# Altium schematic sheet SCC.SchDoc: Solar Charge Controller
size A4; Organization: Thomas Hofmann; Address1: Oberndorferstrasse 41; Address2: 3133 Traismauer; Address3: Lower Austria; Address4: Austria; DocumentNumber: 1; Revision: 1.0; SheetNumber: 1; SheetTotal: 1
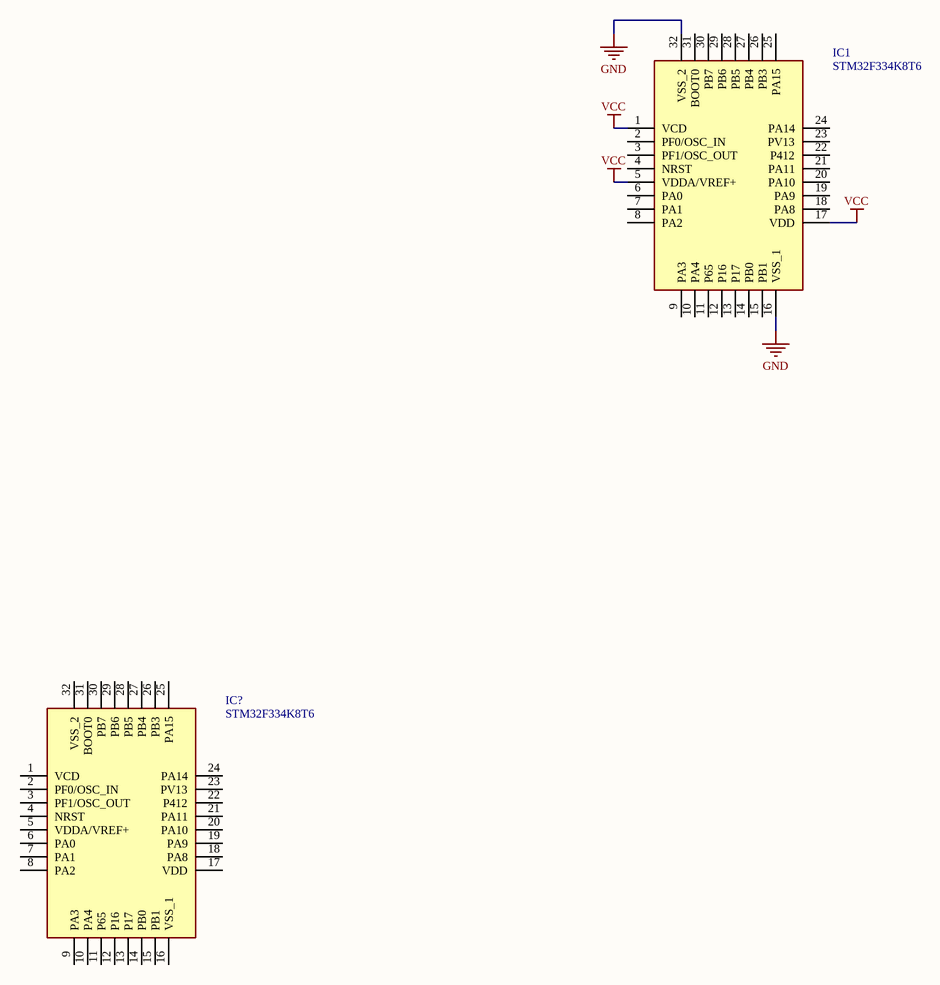
[diagram p0: SCC.SchDoc]

## Parts
IC1  STM32F334K8T6  [QFP80P900X900X160-32N]
IC?  STM32F334K8T6  [QFP80P900X900X160-32N]

## Nets
GND: IC1.16(VSS_1) IC1.32(VSS_2)
VCC: IC1.1(VCD) IC1.5(VDDA/VREF+) IC1.17(VDD)

Not connected (* = marked no-connect by the designer): IC1 2(PF0/OSC_IN) 3(PF1/OSC_OUT) 4(NRST) 6(PA0) 7(PA1) 8(PA2) 9(PA3) 10(PA4) 11(P65) 12(P16) 13(P17) 14(PB0) 15(PB1) 18(PA8) 19(PA9) 20(PA10) 21(PA11) 22(P412) 23(PV13) 24(PA14) 25(PA15) 26(PB3) 27(PB4) 28(PB5) 29(PB6) 30(PB7) 31(BOOT0); IC? 1(VCD) 2(PF0/OSC_IN) 3(PF1/OSC_OUT) 4(NRST) 5(VDDA/VREF+) 6(PA0) 7(PA1) 8(PA2) 9(PA3) 10(PA4) 11(P65) 12(P16) 13(P17) 14(PB0) 15(PB1) 16(VSS_1) 17(VDD) 18(PA8) 19(PA9) 20(PA10) 21(PA11) 22(P412) 23(PV13) 24(PA14) 25(PA15) 26(PB3) 27(PB4) 28(PB5) 29(PB6) 30(PB7) 31(BOOT0) 32(VSS_2)

## Notes on the sheet
- Title
- Size:
- Date:
- A4
- Number:
- Time:
- Revision:
- Sheet
- of
- File:

## Library data of the parts
IC1 IC? = STM32F334K8T6: Integrated Circuit; Manufacturer_Name: STMicroelectronics; Datasheet Link: http://www.st.com/content/ccc/resource/technical/document/datasheet/d1/cd/3d/18/a2/2c/4e/d0/DM00097745.pdf/files/DM00097745.pdf/jcr:content/translations/en.DM00097745.pdf; Height: 1.6mm; Manufacturer_Part_Number: STM32F334K8T6; Arrow Part Number: STM32F334K8T6; Arrow Price/Stock: https://www.arrow.com/en/products/stm32f334k8t6/stmicroelectronics; Mouser Part Number: 511-STM32F334K8T6; Mouser Price/Stock: https://www.mouser.co.uk/ProductDetail/STMicroelectronics/STM32F334K8T6?qs=9MuLHSklicqdmZhsdIQM6A%3D%3D